# EasyEDA schematic SCH_H Bridge with NE555 Version 2_2023-05-05.json
TITLE: Sheet_1; REV: 1.0; Date: 2023-03-08; Sheet: 1/1; Drawn By: richwasnothere; Company: Your Company
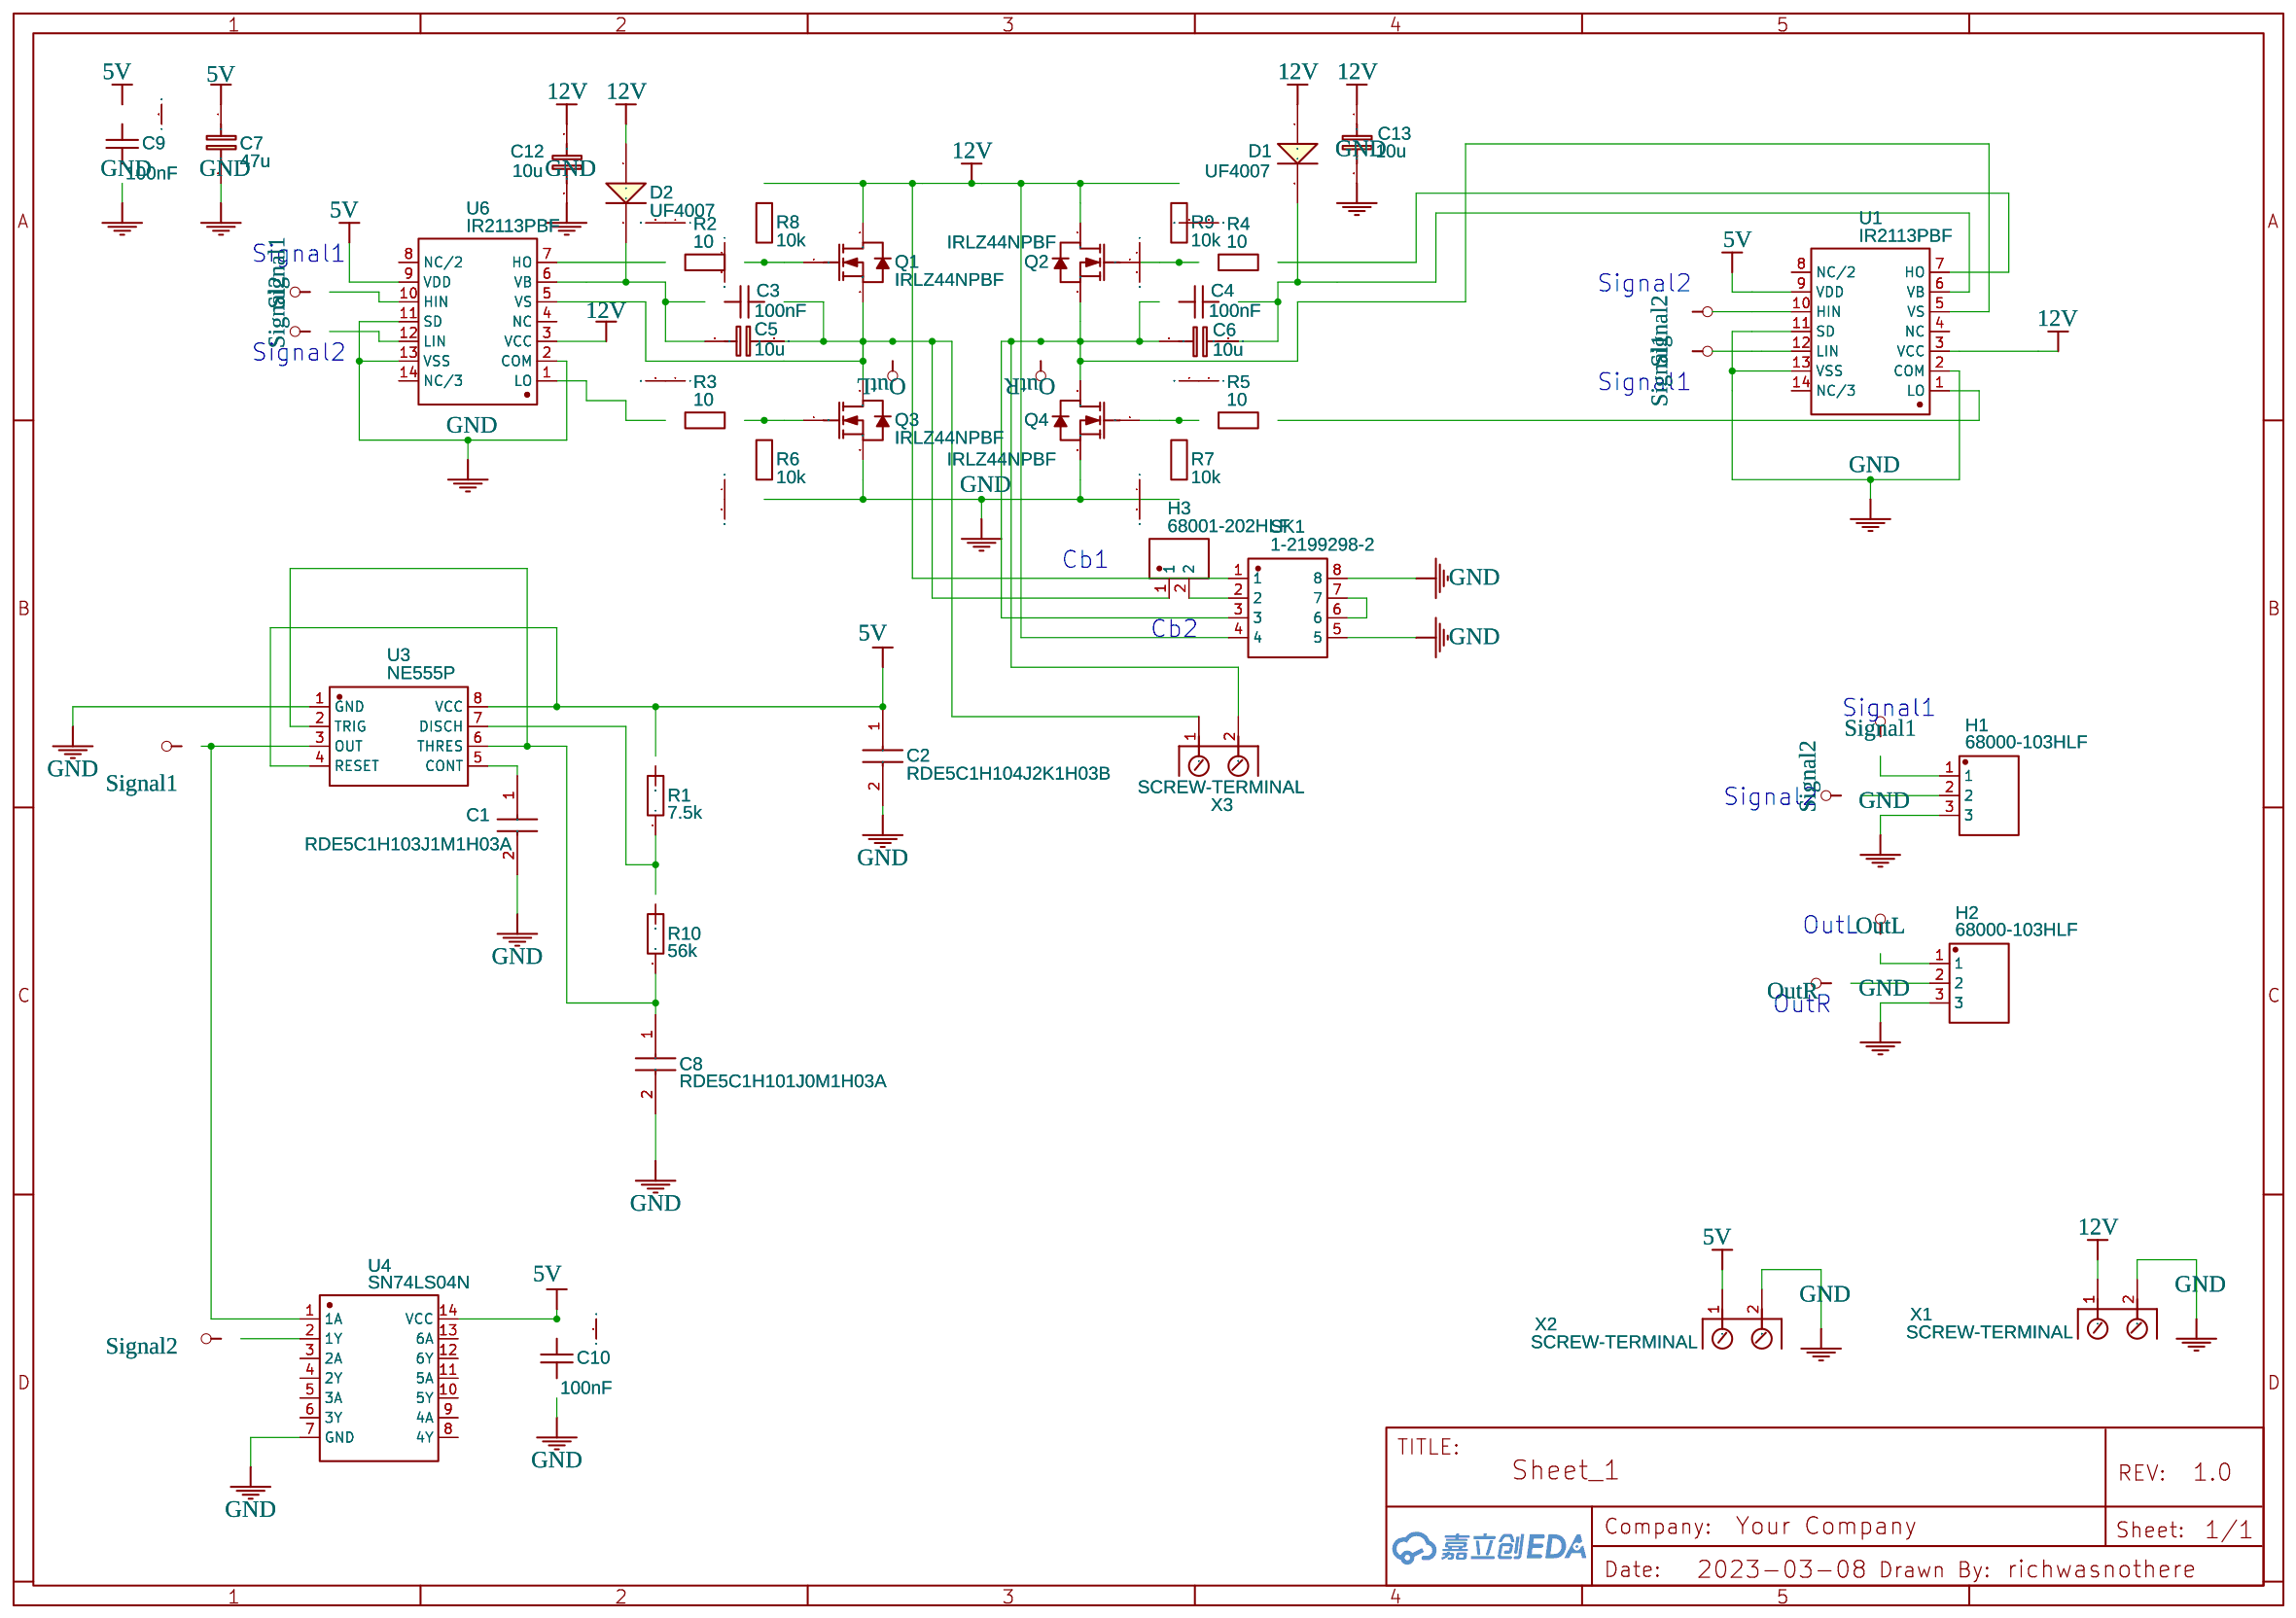
[diagram p0: schematic sheet]

## Parts
C1  RDE5C1H103J1M1H03A  [RDE5C1H103J1K1H03B]
C2  RDE5C1H104J2K1H03B  [RCE5C1H104J2A2H03B]
C3  100nF  [C1]
C4  100nF  [C1]
C5  10u  [CP_8X13MM]
C6  10u  [CP_8X13MM]
C7  47u  [CP_8X13MM]
C8  RDE5C1H101J0M1H03A  [RDE5C1H330J0M1H03A]
C9  100nF  [C1]
C10  100nF  [C1]
C12  10u  [CP_8X13MM]
C13  10u  [CP_8X13MM]
D1  UF4007  [DO-41]
D2  UF4007  [DO-41]
H1  68000-103HLF  [HDR-TH_3P-P2.54-V-M-1]
H2  68000-103HLF  [HDR-TH_3P-P2.54-V-M-1]
H3  68001-202HLF  [HDR-TH_2P-P2.54-V-M-1]
Q1  IRLZ44NPBF  [TO-220-3_L10.0-W4.5-P2.54-T]
Q2  IRLZ44NPBF  [TO-220-3_L10.0-W4.5-P2.54-T]
Q3  IRLZ44NPBF  [TO-220-3_L10.0-W4.5-P2.54-T]
Q4  IRLZ44NPBF  [TO-220-3_L10.0-W4.5-P2.54-T]
R1  7.5k  [R3]
R2  10  [R3]
R3  10  [R3]
R4  10  [R3]
R5  10  [R3]
R6  10k  [R3]
R7  10k  [R3]
R8  10k  [R3]
R9  10k  [R3]
R10  56k  [R3]
SK1  1-2199298-2  [DIP-8_L10.2-W10.2-P2.54-LS7.6-BL]
U1  IR2113PBF  [DIP-14_L19.0-W7.0-P2.54-LS7.6-BL]
U3  NE555P  [DIP-8_L9.8-W6.6-P2.54-LS7.6-BL]
U4  SN74LS04N  [PDIP-14_L19.7-W6.6-P2.54-LS8.3-BL]
U6  IR2113PBF  [DIP-14_L19.0-W7.0-P2.54-LS7.6-BL]
X1  SCREW-TERMINAL  [AKL701_2_13]
X2  SCREW-TERMINAL  [AKL701_2_13]
X3  SCREW-TERMINAL  [AKL701_2_13]

## Library data of the parts
C1 = RDE5C1H103J1M1H03A: Contributor: richwasnothere
C2 = RDE5C1H104J2K1H03B: Contributor: richwasnothere
C3-C7 C9 C10 C12 C13 = Capacitor: Manufacturer Part: ?
C8 = RDE5C1H101J0M1H03A: Contributor: richwasnothere
D1 D2 = -: 1.0 Ampere General Purpose Rectifier; catid: 20; Manufacturer Part: ?
H1 H2 = 68000-103HLF: Supplier: LCSC; Supplier Part: C168677; Manufacturer: Amphenol; Contributor: LCSC; JLCPCB Part Class: Extended Part
H3 = 68001-202HLF: Supplier: LCSC; Supplier Part: C2931354; Manufacturer: Amphenol; link: https://atta.szlcsc.com/upload/public/pdf/source/20210622/C2802682_6FDB3B5212B3A503D0C35E81590DBB9A.pdf; Contributor: LCSC; JLCPCB Part Class: Extended Part
Q1-Q4 = IRLZ44NPBF: Supplier: LCSC; Manufacturer: Infineon(英飞凌); Supplier Part: C38774; JLCPCB Part Class: Extended Part
R1-R10 = Resistor: Manufacturer Part: ?
SK1 = 1-2199298-2: Supplier: LCSC; Supplier Part: C305904; Manufacturer: TE Connectivity(美国泰科); Contributor: LCSC; JLCPCB Part Class: Extended Part
U1 = IR2113PBF: Supplier: LCSC; Manufacturer: Infineon(英飞凌); Supplier Part: C2973; JLCPCB Part Class: Extended Part
U3 = NE555P: Supplier: LCSC; Manufacturer: TI(德州仪器); Supplier Part: C46749; JLCPCB Part Class: Extended Part; Frequency: 100kHz
U4 = SN74LS04N: Supplier: LCSC; Supplier Part: C183657; Manufacturer: TI(德州仪器); Contributor: LCSC; JLCPCB Part Class: Extended Part
U6 = IR2113PBF: Supplier: LCSC; Manufacturer: IR; Supplier Part: C2973; JLCPCB Part Class: Extended Part
X1-X3 = -: catid: 20; sourceId: PU6sECcLl; Manufacturer Part: ?

## Nets
5V: C2.1 C7.1 C9.1 C10.1 R1.2 U1.9(VDD) U3.4(RESET) U3.8(VCC) U4.14(VCC) U6.9(VDD) X2.1
12V: C12.1 C13.1 D1.1(A) D2.1(A) Q1.2(D) Q2.2(D) R8.2 R9.2 SK1.1 SK1.4 U1.3(VCC) U6.3(VCC) X1.1
GND: C1.2 C2.2 C7.2 C8.2 C9.2 C10.2 C12.2 C13.2 H1.3 H2.3 Q3.3(S) Q4.3(S) R6.1 R7.1 SK1.5 SK1.8 U1.2(COM) U1.11(SD) U1.13(VSS) U3.1(GND) U4.7(GND) U6.2(COM) U6.11(SD) U6.13(VSS) X1.2 X2.2
OutL: C3.1 C5.2 H2.1 H3.1 Q1.3(S) Q3.2(D) U6.5(VS) X3.1
OutR: C4.2 C6.2 H2.2 Q2.3(S) Q4.2(D) SK1.3 U1.5(VS) X3.2
Signal1: H1.1 U1.12(LIN) U3.3(OUT) U4.1(1A) U6.10(HIN)
Signal2: H1.2 U1.10(HIN) U4.2(1Y) U6.12(LIN)
Net-(C1-1): C1.1 U3.5(CONT)
Net-(C3-2): C3.2 C5.1 D2.2(K) U6.6(VB)
Net-(C4-1): C4.1 C6.1 D1.2(K) U1.6(VB)
Net-(C8-1): C8.1 R10.1 U3.2(TRIG) U3.6(THRES)
Net-(H3-2): H3.2 SK1.2
Net-(Q1-1): Q1.1(G) R2.2 R8.1
Net-(Q2-1): Q2.1(G) R4.1 R9.1
Net-(Q3-1): Q3.1(G) R3.2 R6.2
Net-(Q4-1): Q4.1(G) R5.1 R7.2
Net-(R1-1): R1.1 R10.2 U3.7(DISCH)
Net-(R2-1): R2.1 U6.7(HO)
Net-(R3-1): R3.1 U6.1(LO)
Net-(R4-2): R4.2 U1.7(HO)
Net-(R5-2): R5.2 U1.1(LO)
Net-(SK1-6): SK1.6 SK1.7

Not connected (* = marked no-connect by the designer): U1 4(NC) 8(NC/2) 14(NC/3); U4 3(2A) 4(2Y) 5(3A) 6(3Y) 8(4Y) 9(4A) 10(5Y) 11(5A) 12(6Y) 13(6A); U6 4(NC) 8(NC/2) 14(NC/3)

## Notes on the sheet
- Signal1
- Signal2
- Signal2
- Signal1
- Cb1
- Cb2
- Signal1
- Signal2
- OutL
- OutR
